# EAGLE schematic hc-sippy (EAGLE 9.5.2)
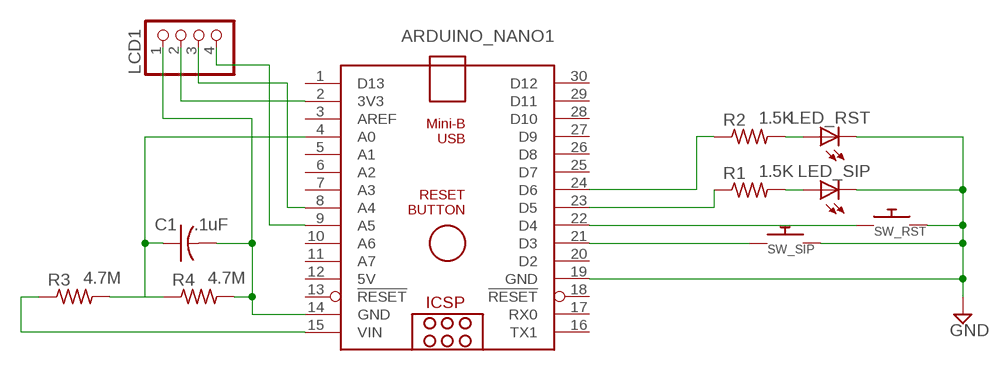
[diagram p0: schematic, sheet 1]

## Parts
ARDUINO_NANO1  ARDUINO_NANO_HCARDUINO_NANO_NO_HOLE  [ARDUINO_NANO_NO_HOLE]
C1  .1uF  C-US025-050X050  [C025-050X050]
LCD1  PINHD-1X4  [1X04]
LED_RST  LED5MM  [LED5MM]
LED_SIP  LED5MM  [LED5MM]
R1  1.5K  R-US_0309/12  [0309/12]
R2  1.5K  R-US_0309/12  [0309/12]
R3  4.7M  R-US_0309/12  [0309/12]
R4  4.7M  R-US_0309/12  [0309/12]
SW_RST  SWITCH_PUSHBUTTONEVQ-PE  [TACT_PANA-EVQ]
SW_SIP  SWITCH_PUSHBUTTONEVQ-PE  [TACT_PANA-EVQ]

## Nets
GND: ARDUINO_NANO1.19(GND) LED_RST.K(C) LED_SIP.K(C) SW_RST.P$2 SW_SIP.P$2
N$1: LED_RST.A R2.2
N$2: LED_SIP.A R1.2
N$3: ARDUINO_NANO1.15(VIN) R3.1
N$4: ARDUINO_NANO1.21(D3) SW_SIP.P$1
N$5: ARDUINO_NANO1.22(D4) SW_RST.P$1
N$6: ARDUINO_NANO1.23(D5) R1.1
N$7: ARDUINO_NANO1.24(D6) R2.1
N$8: ARDUINO_NANO1.4(A0) C1.1 R3.2 R4.1
N$9: ARDUINO_NANO1.14(GND) C1.2 LCD1.1 R4.2
N$10: ARDUINO_NANO1.2(3V3) LCD1.2
N$11: ARDUINO_NANO1.8(A4) LCD1.3
N$12: ARDUINO_NANO1.9(A5) LCD1.4
Unconnected: ARDUINO_NANO1.1(D13) ARDUINO_NANO1.3(AREF) ARDUINO_NANO1.5(A1) ARDUINO_NANO1.6(A2) ARDUINO_NANO1.7(A3) ARDUINO_NANO1.10(A6) ARDUINO_NANO1.11(A7) ARDUINO_NANO1.13(!RESET) ARDUINO_NANO1.16(TX1) ARDUINO_NANO1.17(RX0) ARDUINO_NANO1.18(!RESET) ARDUINO_NANO1.20(D2) ARDUINO_NANO1.25(D7) ARDUINO_NANO1.26(D8) ARDUINO_NANO1.27(D9) ARDUINO_NANO1.28(D10) ARDUINO_NANO1.29(D11) ARDUINO_NANO1.30(D12)

## Power pins joined to a net without a drawn wire
5V: ARDUINO_NANO1.12(5V)

## Library data of the parts
ARDUINO_NANO1 = ArduinoNano_HC:ARDUINO_NANO_HC: Arduino Nano HC Overview: The Arduino Nano is a small, complete, and breadboard-friendly board based on the ATmega328 (Arduino Nano 3.x) or ATmega168 (Arduino Nano 2.x). It has more or less the same functionality of the Arduino Duemilanove, but in a different package. It lacks only a DC power jack, and works with a Mini-B USB cable instead of a standard one. The Nano was designed and is being produced by Gravitech. Specifications: Microcontroller Atmel ATmega168 or ATmega328 Operating Voltage (logic level) 5 V Input Voltage (recommended) 7-12 V Input Voltage (limits) 6-20 V Digital I/O Pins 14 (of which 6 provide PWM output) Analog Input Pins 8 DC Current per I/O Pin 40 mA Flash Memory 16 KB (ATmega168) or 32 KB (ATmega328) of which 2 KB used by bootloader SRAM 1 KB (ATmega168) or 2 KB (ATmega328) EEPROM 512 bytes (ATmega168) or 1 KB (ATmega328) Clock Speed 16 MHz Dimensions 0.73" x 1.70" Length 45 mm Width 18 mm Weigth 5 g Power: The Arduino Nano can be powered via the Mini-B USB connection, 6-20V unregulated external power supply (pin 30), or 5V regulated external power supply (pin 27). The power source is automatically selected to the highest voltage source. Memory: The ATmega168 has 16 KB of flash memory for storing code (of which 2 KB is used for the bootloader); the ATmega328 has 32 KB, (also with 2 KB used for the bootloader). The ATmega168 has 1 KB of SRAM and 512 bytes of EEPROM (which can be read and written with the EEPROM library); the ATmega328 has 2 KB of SRAM and 1 KB of EEPROM. Input and Output: Each of the 14 digital pins on the Nano can be used as an input or output, using pinMode(), digitalWrite(), and digitalRead() functions. They operate at 5 volts. Each pin can provide or receive a maximum of 40 mA and has an internal pull-up resistor (disconnected by default) of 20-50 kOhms. In addition, some pins have specialized functions. Visit Arduino - ArduinoBoardNano <https://www.arduino.cc/en/Main/ArduinoBoardNano>
C1 = akstudios-adafruit:C-US: CAPACITOR, American symbol
LCD1 = pinhead:PINHD-1X4: PIN HEADER
LED_RST LED_SIP = akstudios-adafruit:LED: LED OSRAM: - CHIPLED LG R971, LG N971, LY N971, LG Q971, LY Q971, LO R971, LY R971 LH N974, LH R974 LS Q976, LO Q976, LY Q976 LO Q996 - Hyper CHIPLED LW Q18S LB Q993, LB Q99A, LB R99A - SideLED LS A670, LO A670, LY A670, LG A670, LP A670 LB A673, LV A673, LT A673, LW A673 LH A674 LY A675 LS A676, LA A676, LO A676, LY A676, LW A676 LS A679, LY A679, LG A679 - Hyper Micro SIDELED® LS Y876, LA Y876, LO Y876, LY Y876 LT Y87S - SmartLED LW L88C, LW L88S LB L89C, LB L89S, LG L890 LS L89K, LO L89K, LY L89K LS L896, LA L896, LO L896, LY L896 - TOPLED LS T670, LO T670, LY T670, LG T670, LP T670 LSG T670, LSP T670, LSY T670, LOP T670, LYG T670 LG T671, LOG T671, LSG T671 LB T673, LV T673, LT T673, LW T673 LH T674 LS T676, LA T676, LO T676, LY T676, LB T676, LH T676, LSB T676, LW T676 LB T67C, LV T67C, LT T67C, LS T67K, LO T67K, LY T67K, LW E67C LS E67B, LA E67B, LO E67B, LY E67B, LB E67C, LV E67C, LT E67C LW T67C LS T679, LY T679, LG T679 LS T770, LO T770, LY T770, LG T770, LP T770 LB T773, LV T773, LT T773, LW T773 LH T774 LS E675, LA E675, LY E675, LS T675 LS T776, LA T776, LO T776, LY T776, LB T776 LHGB T686 LT T68C, LB T68C - Hyper Mini TOPLED® LB M676 - Mini TOPLED Santana® LG M470 LS M47K, LO M47K, LY M47K Source: http://www.osram.convergy.de/
R1-R4 = akstudios-adafruit:R-US_: RESISTOR, American symbol
SW_RST SW_SIP = adafruit:SWITCH_PUSHBUTTON: Buttons SOFTTOUCHSMD_SJ - Soft touch temporary push button (Super Junk Akihabara) Compatible with SKPMANE010 [Mouser: 688-SKPMAN] C&K_KSS = Digikey: KSS221GLFS